# EAGLE schematic ReferenceBuildingAmp (EAGLE 9.6.2)
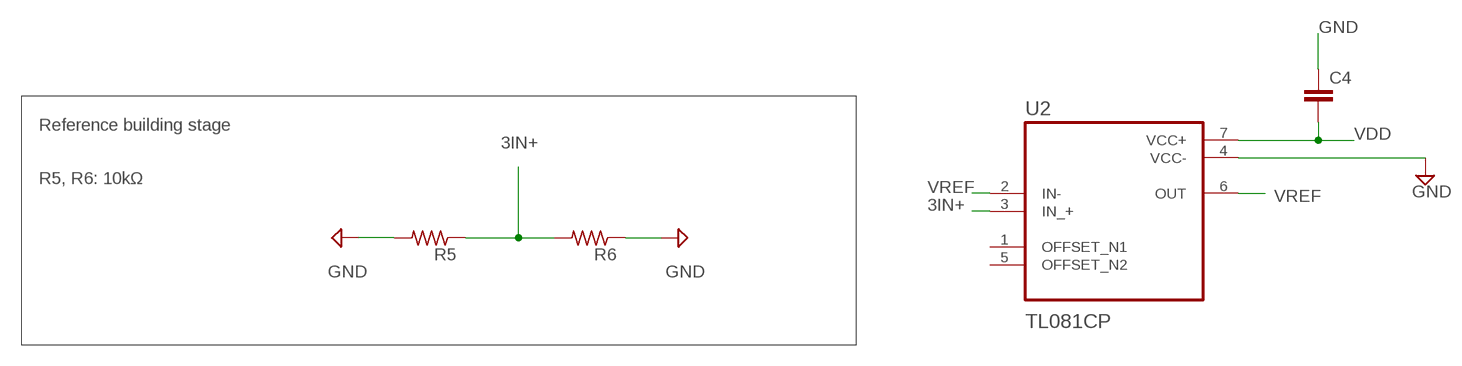
[diagram p0: schematic, sheet 1]

## Parts
C4  C2.5/2  [C2.5-2]
R5  R-US_0204/5  [0204/5]
R6  R-US_0204/5  [0204/5]
U2  TL081CP  [DIP794W45P254L959H508Q8]

## Nets
3IN+: R5.1 R6.2 U2.3(IN_+)
GND: C4.1 R5.2 R6.1
N$10: U2.4(VCC-)
N$11: U2.7(VCC+)
VDD: C4.2
VREF: U2.2(IN-) U2.6(OUT)
Unconnected: U2.1(OFFSET_N1) U2.5(OFFSET_N2)

## Notes on the sheet
- Reference building stage
- R5, R6: 10kΩ

## Library data of the parts
C4 = capacitor-wima:C: CAPACITOR naming: grid - package width
R5 R6 = rcl:R-US_: RESISTOR, American symbol; SPICEPREFIX: R
U2 = TL081CP:TL081CP: Check availability <https://pricing.snapeda.com/parts/TL081CP/Texas%20Instruments/view-part?ref=eda>; AVAILABILITY: In Stock; CHECK_PRICES: https://www.snapeda.com/parts/TL081CP/Texas+Instruments/view-part/?ref=eda; DESCRIPTION: Single, 30-V, 3-MHz, 13-V/µs slew rate, In to V+, JFET-input op amp; MF: Texas Instruments; MP: TL081CP; PACKAGE: PDIP-8 Texas; PRICE: None; PURCHASE-URL: https://www.snapeda.com/api/url_track_click_mouser/?unipart_id=51607&manufacturer=Texas Instruments&part_name=TL081CP&search_term=tl081; SNAPEDA_LINK: https://www.snapeda.com/parts/TL081CP/Texas+Instruments/view-part/?ref=snap